# EAGLE schematic TMR01 (EAGLE 9.2.0)
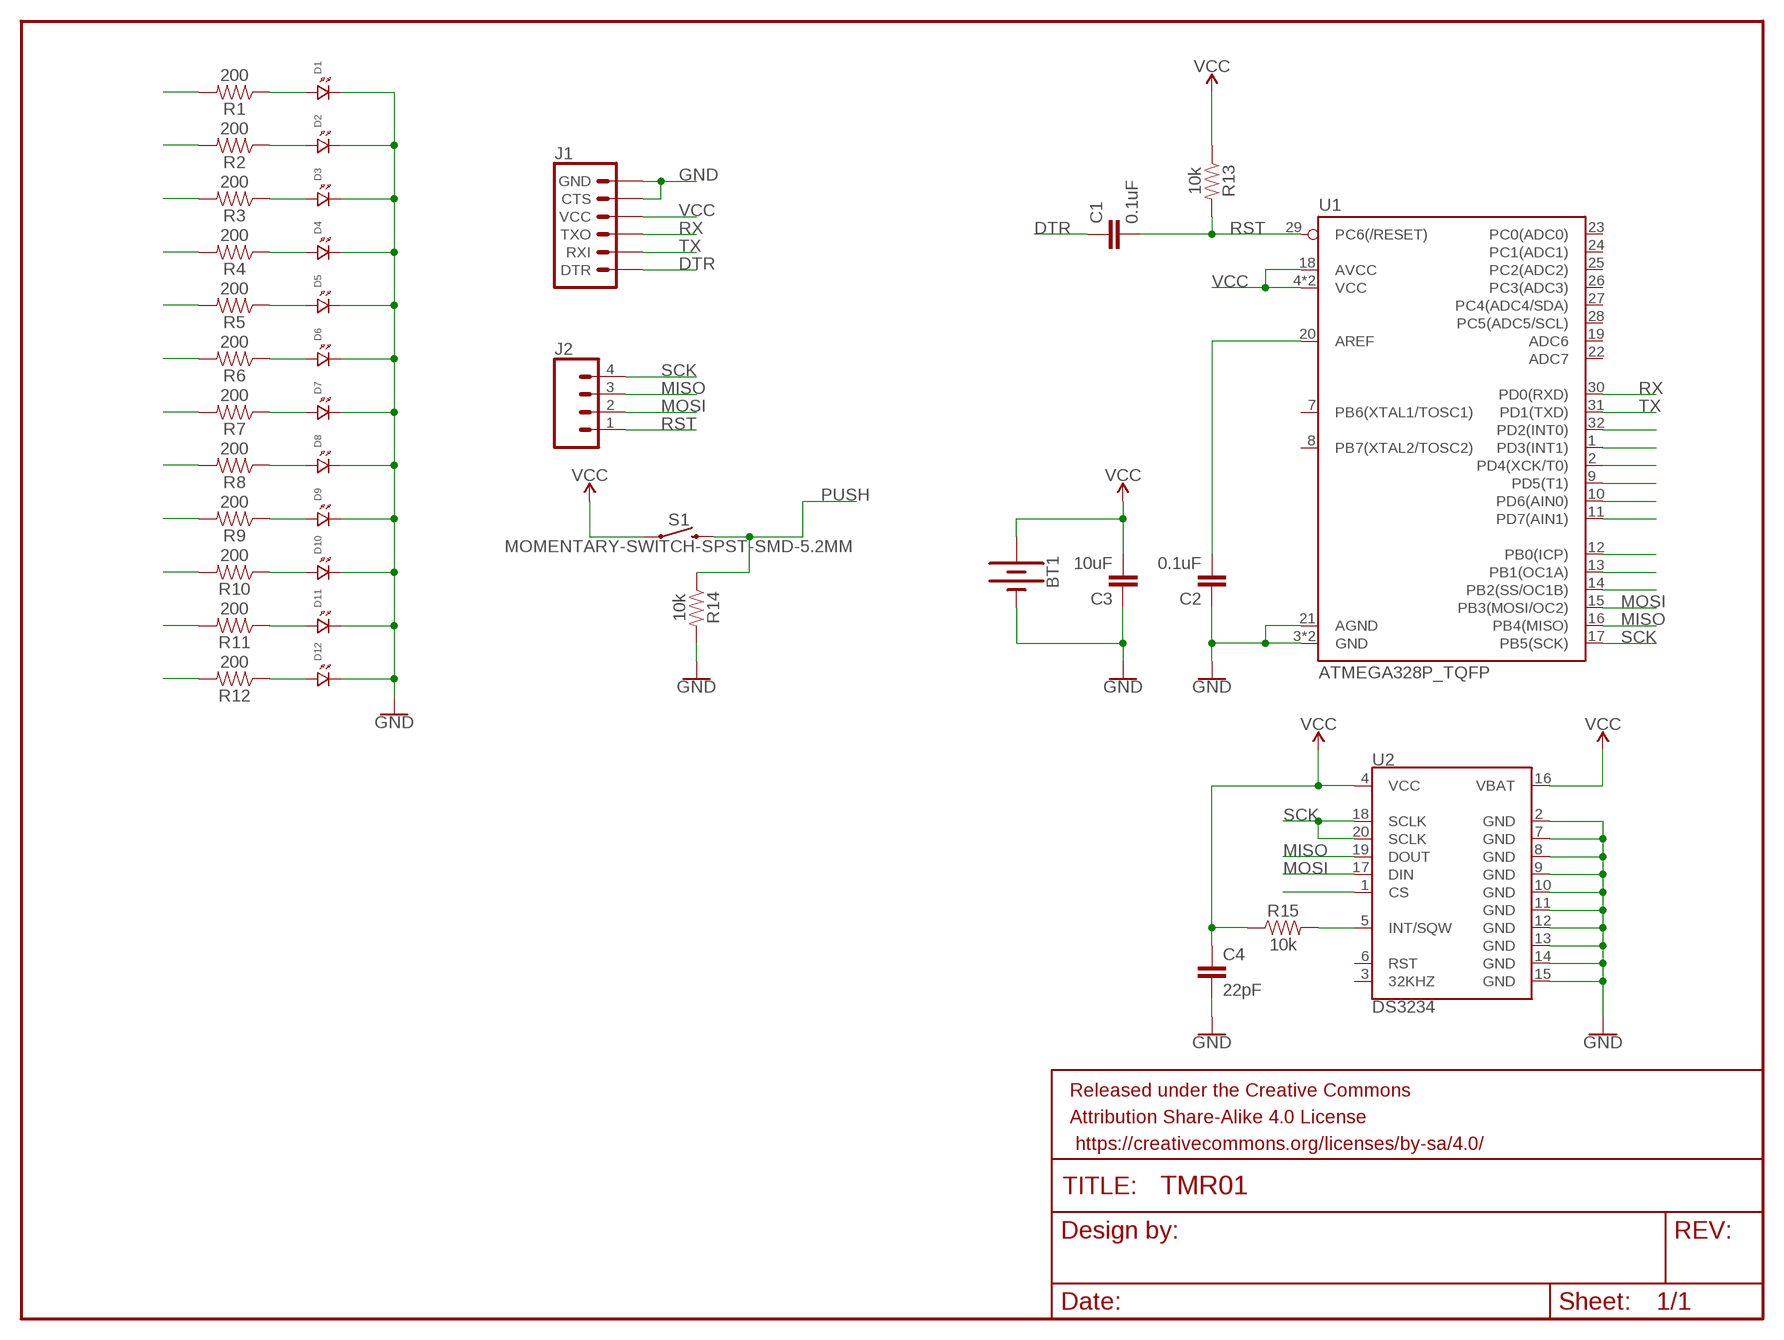
[diagram p0: schematic, sheet 1]

## Parts
BT1  BATTERY-20MM_SMD_4LEGS  [BATTCON_20MM_4LEGS]
C1  0.1uF  0.1UF-0402-16V-10%  [0402]
C2  0.1uF  0.1UF-0402-16V-10%  [0402]
C3  10uF  10UF-0805-10V-10%  [0805]
C4  22pF  CAP_0402  [0402]
D1  LED.0402  [0402.LED]
D2  LED.0402  [0402.LED]
D3  LED.0402  [0402.LED]
D4  LED.0402  [0402.LED]
D5  LED.0402  [0402.LED]
D6  LED.0402  [0402.LED]
D7  LED.0402  [0402.LED]
D8  LED.0402  [0402.LED]
D9  LED.0402  [0402.LED]
D10  LED.0402  [0402.LED]
D11  LED.0402  [0402.LED]
D12  LED.0402  [0402.LED]
FRAME1  FRAME-LETTER  [CREATIVE_COMMONS]
J1  6_PIN_SERIAL_TARGET  [1X06]
J2  CONN_04  [1X04]
R1  200  RESISTOR0402  [0402]
R2  200  RESISTOR0402  [0402]
R3  200  RESISTOR0402  [0402]
R4  200  RESISTOR0402  [0402]
R5  200  RESISTOR0402  [0402]
R6  200  RESISTOR0402  [0402]
R7  200  RESISTOR0402  [0402]
R8  200  RESISTOR0402  [0402]
R9  200  RESISTOR0402  [0402]
R10  200  RESISTOR0402  [0402]
R11  200  RESISTOR0402  [0402]
R12  200  RESISTOR0402  [0402]
R13  10k  RESISTOR0402  [0402]
R14  10k  RESISTOR0402  [0402]
R15  10k  RESISTOR0402  [0402]
S1  MOMENTARY-SWITCH-SPST-SMD-5.2MM  [TACTILE_SWITCH_SMD_5.2MM]
U1  ATMEGA328P_TQFP  [TQFP32-08]
U2  DS3234  [SO20-0.3]

## Nets
DTR: C1.1 J1.1(DTR)
GND: BT1.NEGATIVE(-) C2.1 C3.1 C4.2 D1.P$2 D2.P$2 D3.P$2 D4.P$2 D5.P$2 D6.P$2 D7.P$2 D8.P$2 D9.P$2 D10.P$2 D11.P$2 D12.P$2 J1.5(CTS) J1.6(GND) R14.2 U1.3(GND) U1.5(GND) U1.21(AGND) U2.2(GND) U2.7(GND) U2.8(GND) U2.9(GND) U2.10(GND) U2.11(GND) U2.12(GND) U2.13(GND) U2.14(GND) U2.15(GND)
MISO: J2.3 U1.16(PB4(MISO)) U2.19(DOUT)
MOSI: J2.2 U1.15(PB3(MOSI/OC2)) U2.17(DIN)
N$1: D8.P$1 R8.1
N$2: D7.P$1 R7.1
N$3: D6.P$1 R6.1
N$4: D5.P$1 R5.1
N$5: D4.P$1 R4.1
N$6: D3.P$1 R3.1
N$7: D2.P$1 R2.1
N$8: D1.P$1 R1.1
N$9: R1.2
N$10: R2.2
N$11: R3.2
N$12: R4.2
N$13: R5.2
N$14: R6.2
N$15: R7.2
N$16: R8.2
N$17: C2.2 U1.20(AREF)
N$18: D9.P$1 R9.1
N$19: R9.2
N$20: D10.P$1 R10.1
N$21: R10.2
N$22: D11.P$1 R11.1
N$23: R11.2
N$24: D12.P$1 R12.1
N$25: R12.2
N$26: R15.2 U2.5(INT/SQW)
N$28: U1.14(PB2(SS/OC1B))
N$29: U1.13(PB1(OC1A))
N$30: U1.12(PB0(ICP))
N$33: U1.32(PD2(INT0))
N$34: U1.1(PD3(INT1))
N$35: U1.2(PD4(XCK/T0))
N$36: U1.9(PD5(T1))
N$37: U1.10(PD6(AIN0))
N$38: U1.11(PD7(AIN1))
N$40: U2.1(CS)
PUSH: R14.1 S1.3
RST: C1.2 J2.1 R13.2 U1.29(PC6(/RESET))
RX: J1.3(TXO) U1.30(PD0(RXD))
SCK: J2.4 U1.17(PB5(SCK)) U2.18(SCLK) U2.20(SCLK)
TX: J1.2(RXI) U1.31(PD1(TXD))
VCC: BT1.POSITIVE@1(+) BT1.POSITIVE@2(+) BT1.POSITIVE@3(+) BT1.POSITIVE@4(+) C3.2 C4.1 J1.4(VCC) R13.1 R15.1 S1.1 U1.4(VCC) U1.6(VCC) U1.18(AVCC) U2.4(VCC) U2.16(VBAT)
Unconnected: U1.7(PB6(XTAL1/TOSC1)) U1.8(PB7(XTAL2/TOSC2)) U1.19(ADC6) U1.22(ADC7) U1.23(PC0(ADC0)) U1.24(PC1(ADC1)) U1.25(PC2(ADC2)) U1.26(PC3(ADC3)) U1.27(PC4(ADC4/SDA)) U1.28(PC5(ADC5/SCL)) U2.3(32KHZ) U2.6(RST)

## Library data of the parts
BT1 = SparkFun-Batteries:BATTERY: Battery - Single Cell A variety of battery chemistries, sizes, and footprints. Device List: 20MM_PTH - Coin Cell Battery Holder - 20mm (PTH) <https://www.sparkfun.com/products/783> 20MM_PTH_KIT- Coin Cell battery Holder - 20 mm (PTH) <http://www.sparkfun.com/products/783>kit version with special mask 6.8MM_PTH - Coin Cell Battery Holder - 6.8MM(SMD) <https://www.digikey.com/product-detail/en/seiko-instruments/MS621FE-FL11E/728-1057-ND/1889208?WT.srch=1&gclid=CNOQ5a6LzdQCFZS2wAodXCkE0g> 12MM_SMD - Coin Cell Battery Holder - 12mm (SMD) <https://www.sparkfun.com/products/10592> 12MM_PTH - Coin Cell Battery Holder - 12mm (PTH) <https://www.sparkfun.com/products/7948> 20MM_SMD - 20mm Coin Cell Battery Holder (SMD) (2 legs) Used on the Big Time Watch Kit <https://www.sparkfun.com/products/11734> 20MM_SMD_4LEGS - Coin Cell Battery Holder - 20mm (SMD) <https://www.sparkfun.com/products/11892> 20MM_SMD_4LEGS_OVERPASTE - Coin Cell Battery Holder - 20mm (SMD) <https://www.sparkfun.com/products/11892> (Over-paste on the legs) 24.5MM_PTH - Coin Cell Battery Holder - 24.5mm (PTH) <https://www.sparkfun.com/products/8863> 9V - 9V Battery Holder - PC Mount Used on the SparkFun SparkPunk Sound Kit <https://www.sparkfun.com/products/11177> and SparkFun SparkPunk Sequencer Kit <https://www.sparkfun.com/products/12707> 18650 - Battery Holder - 18650 (PTH) <https://www.sparkfun.com/products/13113> AA - Battery Holder - 1xAA (PTH) <https://www.sparkfun.com/products/7949> AAA - Battery Holder - 1xAAA (PTH) <https://www.sparkfun.com/products/12718> AA_KIT - Battery Holder - 1xAA (PTH) <https://www.sparkfun.com/products/7949> Special kit package - pads only have exposed copper on one side of the board. AAA_KIT - Battery Holder - 1xAAA (PTH) <https://www.sparkfun.com/products/12718> Special kit package - pads only have exposed copper on one side of the board.; PROD_ID: BATT-10373; SF_SKU: PRT-11892
C1 C2 = SparkFun-Capacitors:0.1UF: 0.1µF ceramic capacitors A capacitor is a passive two-terminal electrical component used to store electrical energy temporarily in an electric field.; PROD_ID: CAP-12416
C3 = SparkFun-Capacitors:10UF: 10.0µF ceramic capacitors A capacitor is a passive two-terminal electrical component used to store electrical energy temporarily in an electric field.; PROD_ID: CAP-11330
C4 = Perfect_0402:CAP_0402: 0402 (1005 Metric) Nick Garner - TeleSense
D1-D12 = standardparts:LED
FRAME1 = SparkFun-Aesthetics:FRAME-LETTER: Schematic Frame - Letter Standard 8.5x11 US Letter frame
J1 = SparkFun-Connectors:6_PIN_SERIAL_TARGET: 6-pin header connection for use with the "FTDI BASIC" pinout - TARGET SIDE. Also known as "Arduino Serial Program Header". It is used to mate with our FTDI Basic serial programmers using the Arduino IDE. Note, this device has "TARGET" in the name. It is intended to be used on a design that contains a target micro-controller that you wish to program. The "sister" device, named "CABLE" is inteneded to be used on a design that usually lives on the end of your USB cable and prvides the converter chip (FTDI232 or FTDI231x) to commnicate serial RX/TX. You can populate with some of these: Break Away Headers - Straight <https://www.sparkfun.com/products/116> (PRT-00116) For reference (or to suit your programming needs) check out these designs: SparkFun FTDI Basic Breakout - 5V <https://www.sparkfun.com/products/9716> (DEV-09716) SparkFun FTDI Basic Breakout - 3.3V <https://www.sparkfun.com/products/9873> (DEV-09873) SparkFun FTDI SmartBasic <https://www.sparkfun.com/products/12935> (DEV-12935) SparkFun Beefy 3 - FTDI Basic Breakout <https://www.sparkfun.com/products/13746> (DEV-13746)
J2 = SparkFun-Connectors:CONN_04: Multi connection point. Often used as Generic Header-pin footprint for 0.1 inch spaced/style header connections On any of the 0.1 inch spaced packages, you can populate with these: Break Away Headers - Straight <https://www.sparkfun.com/products/116> (PRT-00116) Break Away Male Headers - Right Angle <https://www.sparkfun.com/products/553> (PRT-00553) Female Headers <https://www.sparkfun.com/products/115> (PRT-00115) Break Away Headers - Machine Pin <https://www.sparkfun.com/products/117> (PRT-00117) Break Away Female Headers - Swiss Machine Pin <https://www.sparkfun.com/products/743> (PRT-00743) For SCREWTERMINALS and SPRING TERMINALS visit here: Screw Terimnals on SparkFun.com <https://www.sparkfun.com/search/results?term=Screw+Terminals> (5mm/3.5mm/2.54mm spacing) This device is also useful as a general connection point to wire up your design to another part of your project. Our various solder wires solder well into these plated through hole pads. Hook-Up Wire - Assortment (Stranded, 22 AWG) <https://www.sparkfun.com/products/11375> (PRT-11375) Hook-Up Wire - Assortment (Solid Core, 22 AWG) <https://www.sparkfun.com/products/11367> (PRT-11367) View the entire wire category on our website here <https://www.sparkfun.com/categories/141> Special notes: Molex polarized connector foot print use with SKU : PRT-08231 with associated crimp pins and housings. 1MM SMD Version SKU: PRT-10208; PROD_ID: CONN-09696
R1-R15 = SparkFun-Resistors:RESISTOR: Generic Resistor Package
S1 = SparkFun-Switches:MOMENTARY-SWITCH-SPST: Momentary Switch (Pushbutton) - SPST Normally-open (NO) SPST momentary switches (buttons, pushbuttons). Variants PTH-12MM - 12mm square, through-hole Momentary Pushbutton Switch - 12mm Square <https://www.sparkfun.com/products/9190> (COM-09190) PTH-6.0MM, PTH-6.0MM-KIT - 6.0mm square, through-hole Mini Pushbutton Switch <https://www.sparkfun.com/products/97> (COM-00097) KIT package intended for soldering kit's - only one side of pads' copper is exposed. PTH-RIGHT-ANGLE-KIT - Right-angle, through-hole Right Angle Tactile Button <https://www.sparkfun.com/products/10791> - Used on SparkFun BigTime Watch Kit <https://www.sparkfun.com/products/11734> SMD-12MM - 12mm square, surface-mount Tactile Button - SMD (12mm) <https://www.sparkfun.com/products/12993> (COM-12993) Used on SparkFun PicoBoard <https://www.sparkfun.com/products/11888> SMD-4.5MM - 4.5mm Square Trackball Switch Used on SparkFun Blackberry Trackballer Breakout <https://www.sparkfun.com/products/13169> SMD-4.6MMX2.8MM - 4.60mm x 2.80mm, surface mount Used on SparkFun SAMD21 Mini Breakout <https://www.sparkfun.com/products/13664> SMD-5.2MM, SMD-5.2-REDUNDANT - 5.2mm square, surface-mount Mini Pushbutton Switch - SMD <https://www.sparkfun.com/products/8720> (COM-08720) Used on Arduino Pro Mini <https://www.sparkfun.com/products/11114> REDUNDANT package connects both switch circuits together SMD-6.0X3.5MM - 6.0 x 3.5mm, surface mount Momentary Reset Switch SMD <https://www.sparkfun.com/products/8229> (COM-08229) SMD-6.2MM-TALL - 6.2mm square, surface mount Tactile Button - SMD (6mm) <https://www.sparkfun.com/products/12992> Used on SparkFun Digital Sandbox <https://www.sparkfun.com/products/12651> SMD-RIGHT-ANGLE - Right-angle, surface mount Used on SparkFun Block for Intel® Edison - Arduino <https://www.sparkfun.com/products/13036>; PROD_ID: SWCH-08247; SF_SKU: COM-08720
U1 = SparkFun-IC-Microcontroller:ATMEGA328P_TQFP: Popular 328P in QFP Storefront component: ATmega328 - TQFP <https://www.sparkfun.com/products/13448> (COM-13448) Datasheet <http://www.sparkfun.com/datasheets/Components/SMD/ATMega328.pdf> SparkFun Products SparkFun RedBoard - Programmed with Arduino <https://www.sparkfun.com/products/12757> (DEV-12757) Arduino Pro Mini 328 - 5V/16MHz <https://www.sparkfun.com/products/11113> (DEV-11113) Arduino Pro Mini 328 - 3.3V/8MHz <https://www.sparkfun.com/products/11114> (DEV-11114) SparkFun OpenLog <https://www.sparkfun.com/products/13712> (DEV-13712) SparkFun MicroView - OLED Arduino Module <https://www.sparkfun.com/products/12923> (DEV-12923) SparkFun Digital Sandbox <https://www.sparkfun.com/products/12651> (DEV-12651) SparkFun PicoBoard <https://www.sparkfun.com/products/11888> (WIG-11888) Arduino Fio <https://www.sparkfun.com/products/10116> (DEV-10116) LilyPad Arduino 328 Main Board <https://www.sparkfun.com/products/13342> (DEV-13342) SparkFun RedStick <https://www.sparkfun.com/products/13741> (DEV-13741) LilyPad MP3 <https://www.sparkfun.com/products/11013> (DEV-11013) LilyPad Arduino SimpleSnap <https://www.sparkfun.com/products/10941> (DEV-10941) SparkFun Stepoko <https://www.sparkfun.com/products/13899> (ROB-13899) SparkFun Geiger Counter <https://www.sparkfun.com/products/11345> (SEN-11345) SparkFun EL Sequencer <https://www.sparkfun.com/products/12781> (COM-12781) Arduino Pro 328 - 5V/16MHz <https://www.sparkfun.com/products/10915> (DEV-10915) CryptoCape <https://www.sparkfun.com/products/12773> (DEV-12773) SparkFun IR Thermometer Evaluation Board - MLX90614 <https://www.sparkfun.com/products/10740> (SEN-10740) SparkFun RedBot Mainboard <https://www.sparkfun.com/products/12097> (ROB-12097) Arduino Pro 328 - 3.3V/8MHz <https://www.sparkfun.com/products/10914> (DEV-10914) SparkFun Block for Intel® Edison - Arduino <https://www.sparkfun.com/products/13036> (DEV-13036) SparkFun Simon Says - Surface Mount Soldering Kit <https://www.sparkfun.com/products/10935> (KIT-10935) SparkFun 7-Segment Serial Display - Red <https://www.sparkfun.com/products/11441> (COM-11441) SparkFun 7-Segment Serial Display - White <https://www.sparkfun.com/products/11629> (COM-11629) SparkFun 7-Segment Serial Display - Yellow <https://www.sparkfun.com/products/11443> (COM-11443) SparkFun 7-Segment Serial Display - Kelly Green <https://www.sparkfun.com/products/11440> (COM-11440) SparkFun 7-Segment Serial Display - Blue <https://www.sparkfun.com/products/11442> (COM-11442) SparkFun OpenSegment Serial Display - 20mm (Blue) <https://www.sparkfun.com/products/11647> (COM-11647) SparkFun OpenSegment Serial Display - 20mm (Green) <https://www.sparkfun.com/products/11646> (COM-11646) SparkFun OpenSegment Serial Display - 20mm (White) <https://www.sparkfun.com/products/11648> (COM-11648) SparkFun OpenSegment Serial Display - 20mm (Red) <https://www.sparkfun.com/products/11644> (COM-11644) SparkFun OpenSegment Serial Display - 20mm (Yellow) <https://www.sparkfun.com/products/11645> (COM-11645) SparkFun OpenSegment Shield <https://www.sparkfun.com/products/13190> (DEV-13190); PROD_ID: IC-09069
U2 = SparkFun-Clocks:DS3234: Maxim DS3234 - Extremely Accurate SPI RTC The DS3234 is a low-cost, extremely accurate SPI™ bus real-time clock (RTC) with an integrated temperature-compensated crystal oscillator (TCXO) and crystal. SparkFun Products: Real Time Clock - DS3234 <https://www.sparkfun.com/products/10079> (COM-10079) SparkFun DeadOn RTC Breakout <https://www.sparkfun.com/products/10160> (BOB-10160) Datasheet <https://www.sparkfun.com/datasheets/BreakoutBoards/DS3234.pdf>; PROD_ID: IC-10016; SF_ID: COM-10079